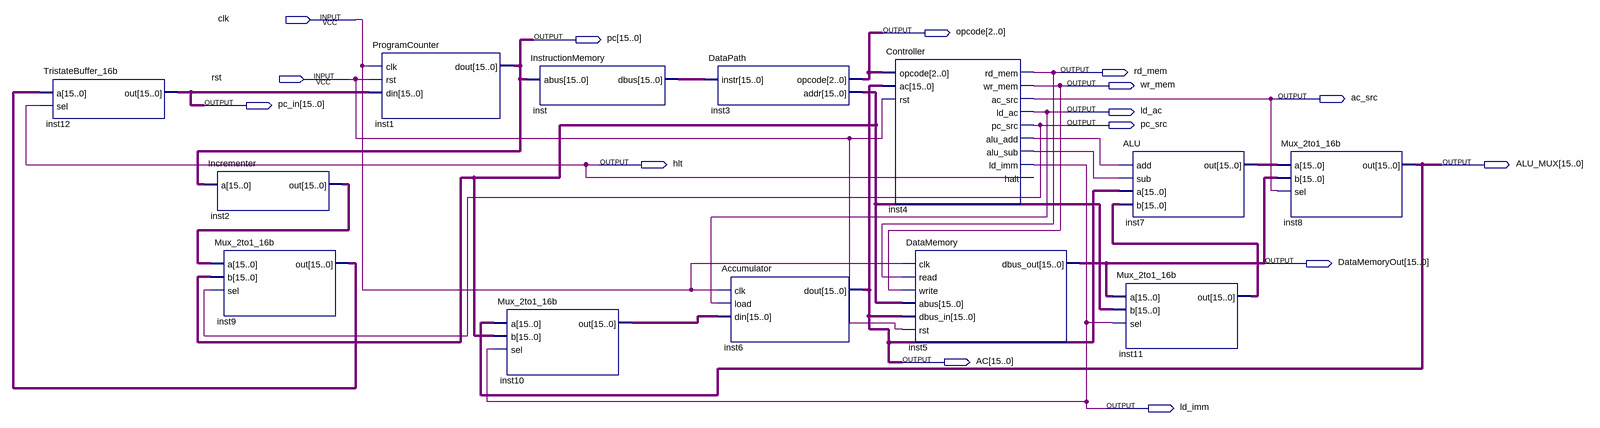
[diagram p0: schematic sheet]
// Quartus schematic hw05.bdf as structural Verilog: 13 symbols, 15 pins
module hw05 (
  input  clk,
  input  rst,
  output [2:0] opcode,
  output [15:0] pc,
  output rd_mem,
  output wr_mem,
  output ac_src,
  output [15:0] pc_in,
  output ld_ac,
  output pc_src,
  output hlt,
  output [15:0] ALU_MUX,
  output [15:0] DataMemoryOut,
  output [15:0] AC,
  output ld_imm
);

  wire inst4_alu_add, inst4_alu_sub;
  wire [15:0] inst2_out, inst3_addr, inst7_out, inst9_out, inst10_out, inst11_out, inst_dbus;

  TristateBuffer_16b inst12 (.a(inst9_out), .sel(hlt), .out(pc_in));
  Incrementer inst2 (.a(pc), .out(inst2_out));
  Mux_2to1_16b inst9 (.a(inst2_out), .b(inst3_addr), .sel(pc_src), .out(inst9_out));
  ProgramCounter inst1 (.clk(clk), .rst(rst), .din(pc_in), .dout(pc));
  Mux_2to1_16b inst10 (.a(ALU_MUX), .b(inst3_addr), .sel(ld_imm), .out(inst10_out));
  InstructionMemory inst (.abus(pc), .dbus(inst_dbus));
  DataPath inst3 (.instr(inst_dbus), .opcode(opcode), .addr(inst3_addr));
  Accumulator inst6 (.clk(clk), .load(ld_ac), .din(inst10_out), .dout(AC));
  Controller inst4 (
    .opcode(opcode), .ac(AC), .rst(rst), .rd_mem(rd_mem), .wr_mem(wr_mem), .ac_src(ac_src), .ld_ac(ld_ac),
    .pc_src(pc_src), .alu_add(inst4_alu_add), .alu_sub(inst4_alu_sub), .ld_imm(ld_imm), .halt(hlt));
  DataMemory inst5 (
    .clk(clk), .read(rd_mem), .write(wr_mem), .abus(inst3_addr), .dbus_in(AC), .rst(rst),
    .dbus_out(DataMemoryOut));
  ALU inst7 (.add(inst4_alu_add), .sub(inst4_alu_sub), .a(AC), .b(inst11_out), .out(inst7_out));
  Mux_2to1_16b inst11 (.a(DataMemoryOut), .b(inst3_addr), .sel(ld_imm), .out(inst11_out));
  Mux_2to1_16b inst8 (.a(inst7_out), .b(DataMemoryOut), .sel(ac_src), .out(ALU_MUX));
endmodule
